# EAGLE design GD32Fx07R-dev-board (EAGLE 9.6.2)
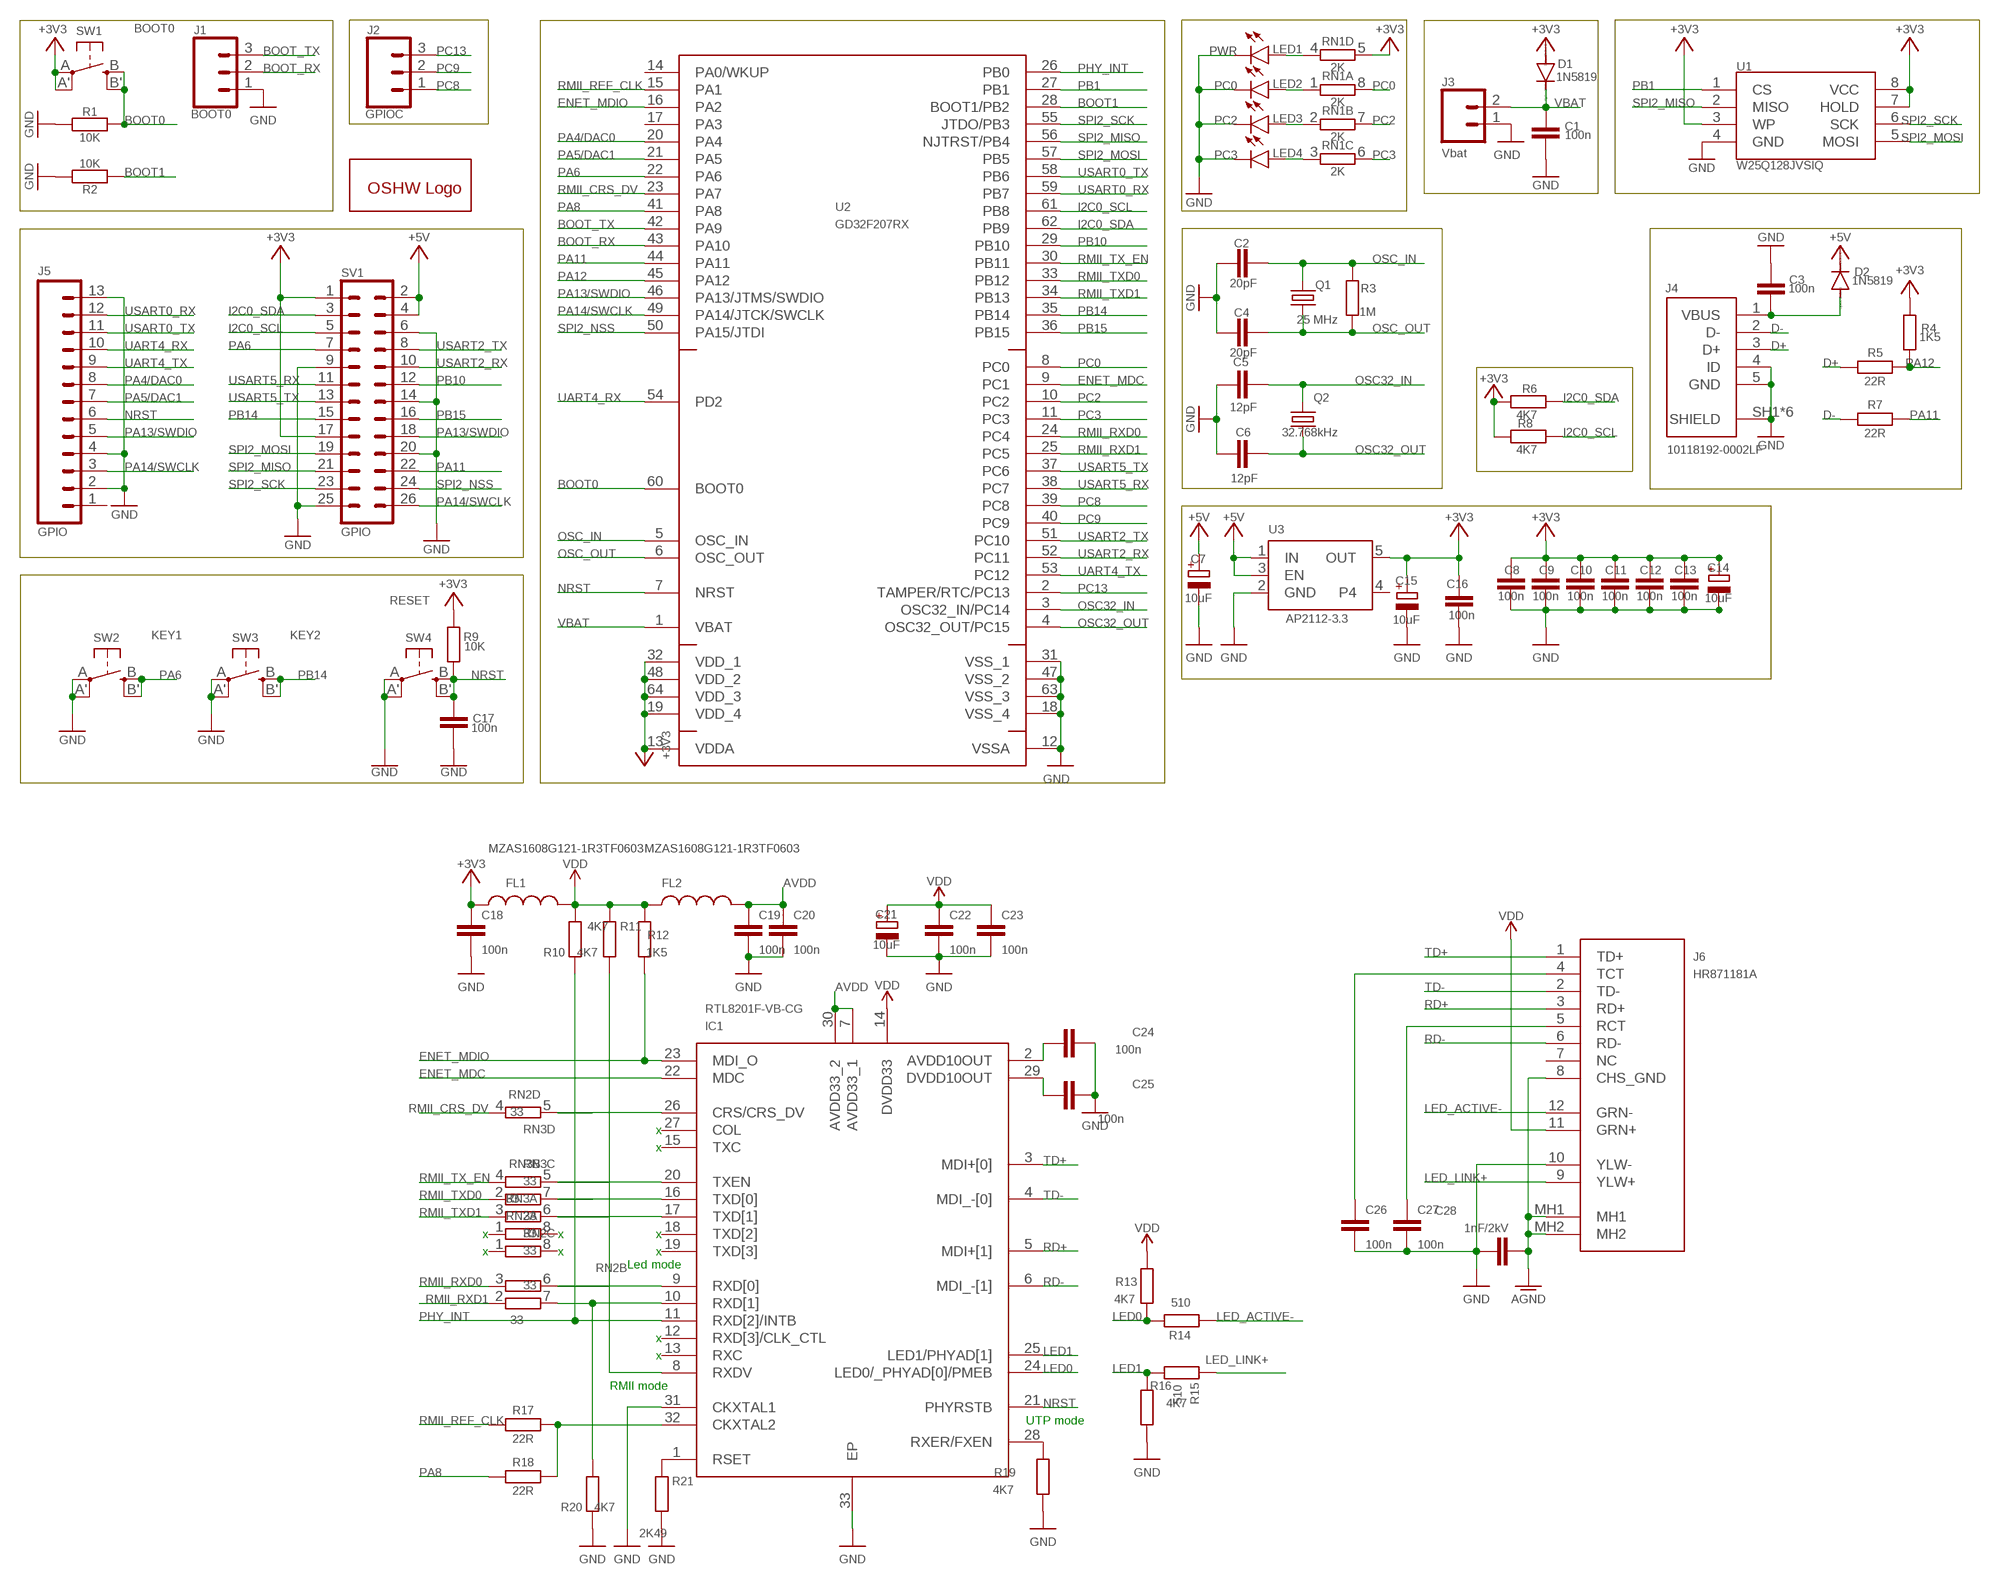
[diagram p0: schematic, sheet 1]

## Parts
C1  100n  C-EUC0603  [C0603]
C2  20pF  C-EUC0603  [C0603]
C3  100n  C-EUC0603  [C0603]
C4  20pF  C-EUC0603  [C0603]
C5  12pF  C-EUC0603  [C0603]
C6  12pF  C-EUC0603  [C0603]
C7  10uF  CPOL-EUA/3216-18R  [A/3216-18R]
C8  100n  C-EUC0603  [C0603]
C9  100n  C-EUC0603  [C0603]
C10  100n  C-EUC0603  [C0603]
C11  100n  C-EUC0603  [C0603]
C12  100n  C-EUC0603  [C0603]
C13  100n  C-EUC0603  [C0603]
C14  10uF  CPOL-EUA/3216-18R  [A/3216-18R]
C15  10uF  CPOL-EUA/3216-18R  [A/3216-18R]
C16  100n  C-EUC0603  [C0603]
C17  100n  C-EUC0603  [C0603]
C18  100n  C-EUC0603  [C0603]
C19  100n  C-EUC0603  [C0603]
C20  100n  C-EUC0603  [C0603]
C21  10uF  CPOL-EUA/3216-18R  [A/3216-18R]
C22  100n  C-EUC0603  [C0603]
C23  100n  C-EUC0603  [C0603]
C24  100n  C-EUC0603  [C0603]
C25  100n  C-EUC0603  [C0603]
C26  100n  C-EUC0603  [C0603]
C27  100n  C-EUC0603  [C0603]
C28  1nF/2kV  C-EUC1206  [C1206]
D1  1N5819  DIODE-SOD323-R  [SOD323-R]
D2  1N5819  DIODE-SOD323-R  [SOD323-R]
FL1  MZAS1608G121-1R3TF0603  [0603]
FL2  MZAS1608G121-1R3TF0603  [0603]
GOLD_ORB_SM1  OSHWLOGOLOGO5MM  [OSHW_5MM]
IC1  RTL8201F-VB-CG  [QFN50P500X500X100-33N]
J1  BOOT0  CONN_03  [1X03]
J2  GPIOC  CONN_03  [1X03]
J3  Vbat  CONN_021X02_NO_SILK  [1X02_NO_SILK]
J4  10118192-0002LF  [10118192-0002LF]
J5  GPIO  CONN_13  [1X13]
J6  HR871181A  [HR871181A]
LED1  PWR  LEDCHIP-LED0603  [CHIP-LED0603]
LED2  PC0  LEDCHIP-LED0603  [CHIP-LED0603]
LED3  PC2  LEDCHIP-LED0603  [CHIP-LED0603]
LED4  PC3  LEDCHIP-LED0603  [CHIP-LED0603]
Q1  25 MHz  CSM-7X-DU  [CSM-7X-DU]
Q2  32.768kHz  KX-327-NHT  [3.2X1.5]
R1  10K  R-EU_R0603  [R0603]
R2  10K  R-EU_R0603  [R0603]
R3  1M  R-EU_R0603  [R0603]
R4  1K5  R-EU_R0603  [R0603]
R5  22R  R-EU_R0603  [R0603]
R6  4K7  R-EU_R0603  [R0603]
R7  22R  R-EU_R0603  [R0603]
R8  4K7  R-EU_R0603  [R0603]
R9  10K  R-EU_R0603  [R0603]
R10  4K7  R-EU_R0603  [R0603]
R11  4K7  R-EU_R0603  [R0603]
R12  1K5  R-EU_R0603  [R0603]
R13  4K7  R-EU_R0603  [R0603]
R14  510  R-EU_R0603  [R0603]
R15  510  R-EU_R0603  [R0603]
R16  4K7  R-EU_R0603  [R0603]
R17  22R  R-EU_R0603  [R0603]
R18  22R  R-EU_R0603  [R0603]
R19  4K7  R-EU_R0603  [R0603]
R20  4K7  R-EU_R0603  [R0603]
R21  2K49  R-EU_R0603  [R0603]
RN1  2K  4R-N0402ARV341  [4X0402ARV341]
RN2  33  4R-N0402ARV341  [4X0402ARV341]
RN3  33  4R-N0402ARV341  [4X0402ARV341]
SV1  GPIO  GPIO-13-2  [MA13-2]
SW1  BOOT0  SPST_TACT-EVQQ2  [EVQ-Q2]
SW2  KEY1  SPST_TACT-EVQQ2  [EVQ-Q2]
SW3  KEY2  SPST_TACT-EVQQ2  [EVQ-Q2]
SW4  RESET  SPST_TACT-EVQQ2  [EVQ-Q2]
U1  W25Q128JVSIQ  SPI_FLASH-X25XXSMD1  [SO08-EIAJ]
U2  GD32F207RX  [LQFP64]
U3  AP2112-3.3  LDO  [SOT23-5]

## Nets
+3V3: C8.1 C9.1 C10.1 C11.1 C12.1 C13.1 C14.+ C15.+ C16.1 C18.1 D1.A FL1.1 R4.2 R6.2 R8.2 R9.2 RN1.5 SV1.1 SV1.17 SW1.A'(P1) SW1.A(P) U1.3(WP) U1.7(HOLD) U1.8(VCC) U2.13(VDDA) U2.19(VDD_4) U2.32(VDD_1) U2.48(VDD_2) U2.64(VDD_3) U3.5(OUT)
+5V: C7.+ D2.C SV1.2 SV1.4 U3.1(IN) U3.3(EN)
AGND: C28.2 J6.8(CHS_GND) J6.MH1 J6.MH2
AVDD: C19.1 C20.1 FL2.2 IC1.7(AVDD33_1) IC1.30(AVDD33_2)
BOOT0: R1.2 SW1.B'(S1) SW1.B(S) U2.60(BOOT0)
BOOT1: R2.1 U2.28(BOOT1/PB2)
BOOT_RX: J1.2 U2.43(PA10)
BOOT_TX: J1.3 U2.42(PA9)
CLOCK: IC1.32(CKXTAL2) R17.2 R18.2
D+: J4.3(D+) R5.1
D-: J4.2(D-) R7.1
ENET_MDC: IC1.22(MDC) U2.9(PC1)
ENET_MDIO: IC1.23(MDI_O) R12.1 U2.16(PA2)
GND: C1.2 C2.1 C3.1 C4.1 C5.1 C6.1 C7.- C8.2 C9.2 C10.2 C11.2 C12.2 C13.2 C14.- C15.- C16.2 C17.2 C18.2 C19.2 C20.2 C21.- C22.2 C23.2 C24.1 C25.1 C26.2 C27.2 C28.1 IC1.31(CKXTAL1) IC1.33(EP) J1.1 J3.1 J4.4(ID) J4.5(GND) J4.SH1(SHIELD) J4.SH2(SHIELD) J4.SH3(SHIELD) J4.SH4(SHIELD) J4.SH5(SHIELD) J4.SH6(SHIELD) J5.2 J5.4 J5.13 J6.10(YLW-) LED1.C LED2.C LED3.C LED4.C R1.1 R2.2 R16.1 R19.1 R20.1 R21.2 SV1.6 SV1.9 SV1.14 SV1.20 SV1.25 SW2.A'(P1) SW2.A(P) SW3.A'(P1) SW3.A(P) SW4.A'(P1) SW4.A(P) U1.4(GND) U2.12(VSSA) U2.18(VSS_4) U2.31(VSS_1) U2.47(VSS_2) U2.63(VSS_3) U3.2(GND)
I2C0_SCL: R8.1 SV1.5 U2.61(PB8)
I2C0_SDA: R6.1 SV1.3 U2.62(PB9)
LED0: IC1.24(LED0/_PHYAD[0]/PMEB) R13.1 R14.2
LED1: IC1.25(LED1/PHYAD[1]) R15.2 R16.2
LED_ACTIVE-: J6.12(GRN-) R14.1
LED_LINK+: J6.9(YLW+) R15.1
N$1: C24.2 IC1.2(AVDD10OUT)
N$4: IC1.1(RSET) R21.1
N$5: IC1.8(RXDV) R11.2
N$6: C25.2 IC1.29(DVDD10OUT)
N$7: IC1.28(RXER/FXEN) R19.2
N$9: C27.1 J6.5(RCT)
N$10: LED2.A RN1.1
N$11: LED3.A RN1.2
N$12: C26.1 J6.4(TCT)
N$25: LED4.A RN1.3
N$26: LED1.A RN1.4
NRST: C17.1 IC1.21(PHYRSTB) J5.6 R9.1 SW4.B'(S1) SW4.B(S) U2.7(NRST)
OSC32_IN: C5.2 Q2.2 U2.3(OSC32_IN/PC14)
OSC32_OUT: C6.2 Q2.1 U2.4(OSC32_OUT/PC15)
OSC_IN: C2.2 Q1.2 R3.1 U2.5(OSC_IN)
OSC_OUT: C4.2 Q1.1 R3.2 U2.6(OSC_OUT)
PA4/DAC0: J5.8 U2.20(PA4)
PA5/DAC1: J5.7 U2.21(PA5)
PA6: SV1.7 SW2.B'(S1) SW2.B(S) U2.22(PA6)
PA8: R18.1 U2.41(PA8)
PA11: R7.2 SV1.22 U2.44(PA11)
PA12: R4.1 R5.2 U2.45(PA12)
PA13/SWDIO: J5.5 SV1.18 U2.46(PA13/JTMS/SWDIO)
PA14/SWCLK: J5.3 SV1.26 U2.49(PA14/JTCK/SWCLK)
PB1: U1.1(CS) U2.27(PB1)
PB10: SV1.12 U2.29(PB10)
PB14: SV1.15 SW3.B'(S1) SW3.B(S) U2.35(PB14)
PB15: SV1.16 U2.36(PB15)
PC0: RN1.8 U2.8(PC0)
PC2: RN1.7 U2.10(PC2)
PC3: RN1.6 U2.11(PC3)
PC8: J2.1 U2.39(PC8)
PC9: J2.2 U2.40(PC9)
PC13: J2.3 U2.2(TAMPER/RTC/PC13)
PHY_INT: IC1.11(RXD[2]/INTB) R10.1 U2.26(PB0)
RD+: IC1.5(MDI+[1]) J6.3(RD+)
RD-: IC1.6(MDI_-[1]) J6.6(RD-)
RMII_CRS_DV: RN2.4 U2.23(PA7)
RMII_REF_CLK: R17.1 U2.15(PA1)
RMII_RXD0: RN2.3 U2.24(PC4)
RMII_RXD1: RN2.2 U2.25(PC5)
RMII_TX_EN: RN3.4 U2.30(PB11)
RMII_TXD0: RN3.2 U2.33(PB12)
RMII_TXD1: RN3.3 U2.34(PB13)
RXD0: IC1.9(RXD[0]) RN2.6
RXD1: IC1.10(RXD[1]) R20.2 RN2.7
RXDV: IC1.26(CRS/CRS_DV) RN2.5
SPI2_MISO: SV1.21 U1.2(MISO) U2.56(NJTRST/PB4)
SPI2_MOSI: SV1.19 U1.5(MOSI) U2.57(PB5)
SPI2_NSS: SV1.24 U2.50(PA15/JTDI)
SPI2_SCK: SV1.23 U1.6(SCK) U2.55(JTDO/PB3)
TD+: IC1.3(MDI+[0]) J6.1(TD+)
TD-: IC1.4(MDI_-[0]) J6.2(TD-)
TXD0: IC1.16(TXD[0]) RN3.7
TXD1: IC1.17(TXD[1]) RN3.6
TXEN: IC1.20(TXEN) RN3.5
UART4_RX: J5.10 U2.54(PD2)
UART4_TX: J5.9 U2.53(PC12)
USART0_RX: J5.12 U2.59(PB7)
USART0_TX: J5.11 U2.58(PB6)
USART2_RX: SV1.10 U2.52(PC11)
USART2_TX: SV1.8 U2.51(PC10)
USART5_RX: SV1.11 U2.38(PC7)
USART5_TX: SV1.13 U2.37(PC6)
VBAT: C1.1 D1.C J3.2 U2.1(VBAT)
VBUS: C3.2 D2.A J4.1(VBUS)
VDD: C21.+ C22.1 C23.1 FL1.2 FL2.1 IC1.14(DVDD33) J6.11(GRN+) R10.2 R11.1 R12.2 R13.2
Unconnected: IC1.12(RXD[3]/CLK_CTL) IC1.13(RXC) IC1.15(TXC) IC1.18(TXD[2]) IC1.19(TXD[3]) IC1.27(COL) J5.1 J6.7(NC) RN2.1 RN2.8 RN3.1 RN3.8 U2.14(PA0/WKUP) U2.17(PA3) U3.4

## Notes on the sheet
- x
- x
- x | x | x
- x | x | x
- Led mode
- x
- x
- RMII mode
- UTP mode

## Library data of the parts
C1 C3 C8-C13 C16-C20 C22-C27 = rcl:C-EU: CAPACITOR, European symbol; JLCPCB: C14663; SPICEPREFIX: C
C2 C4-C6 = rcl:C-EU: CAPACITOR, European symbol; JLCPCB: C38523; SPICEPREFIX: C
C7 C14 C15 C21 = rcl:CPOL-EU: POLARIZED CAPACITOR, European symbol; JLCPCB: C7171; SPICEPREFIX: C
C28 = rcl:C-EU: CAPACITOR, European symbol; JLCPCB: C9196; SPICEPREFIX: C
D1 D2 = diode:DIODE-: DIODE; JLCPCB: C191023
FL1 FL2 = Ethernet:MZAS1608G121-1R3TF: 1.3A 1 140mΩ 120Ω@100MHz ±25% 0603 Ferrite Beads ROHS; JLCPCB: C709642
GOLD_ORB_SM1 = oshw:OSHWLOGO: The OSHW logo for PCB layout
IC1 = Ethernet:RTL8201F-VB-CG: RTL8201F Series 3.63 V Single Chip/Port 10/100 M Ethernet Phyceiver w/ auto MDIX Source: Datasheet <https://pdf1.alldatasheet.com/datasheet-pdf/view/1132250/REALTEK/RTL8201F-VB-CG.html>; DESCRIPTION: RTL8201F Series 3.63 V Single Chip/Port 10/100 M Ethernet Phyceiver w/ auto MDIX; JLCPCB: C45044; MANUFACTURER_NAME: Realtek; MANUFACTURER_PART_NUMBER: RTL8201F-VB-CG
J1 J2 = SparkFun-Connectors:CONN_03: Multi connection point. Often used as Generic Header-pin footprint for 0.1 inch spaced/style header connections On any of the 0.1 inch spaced packages, you can populate with these: Break Away Headers - Straight <https://www.sparkfun.com/products/116> (PRT-00116) Break Away Male Headers - Right Angle <https://www.sparkfun.com/products/553> (PRT-00553) Female Headers <https://www.sparkfun.com/products/115> (PRT-00115) Break Away Headers - Machine Pin <https://www.sparkfun.com/products/117> (PRT-00117) Break Away Female Headers - Swiss Machine Pin <https://www.sparkfun.com/products/743> (PRT-00743) Stackable Header - 3 Pin (Female, 0.1") <https://www.sparkfun.com/products/13875> (PRT-13875) For SCREWTERMINALS and SPRING TERMINALS visit here: Screw Terimnals on SparkFun.com <https://www.sparkfun.com/search/results?term=Screw+Terminals> (5mm/3.5mm/2.54mm spacing) This device is also useful as a general connection point to wire up your design to another part of your project. Our various solder wires solder well into these plated through hole pads. Hook-Up Wire - Assortment (Stranded, 22 AWG) <https://www.sparkfun.com/products/11375> (PRT-11375) Hook-Up Wire - Assortment (Solid Core, 22 AWG) <https://www.sparkfun.com/products/11367> (PRT-11367) View the entire wire category on our website here <https://www.sparkfun.com/categories/141> Special notes: Molex polarized connector foot print use with SKU : PRT-08232 with associated crimp pins and housings.
J3 = SparkFun-Connectors:CONN_02: Multi connection point. Often used as Generic Header-pin footprint for 0.1 inch spaced/style header connections On any of the 0.1 inch spaced packages, you can populate with these: Break Away Headers - Straight <https://www.sparkfun.com/products/116> (PRT-00116) Break Away Male Headers - Right Angle <https://www.sparkfun.com/products/553> (PRT-00553) Female Headers <https://www.sparkfun.com/products/115> (PRT-00115) Break Away Headers - Machine Pin <https://www.sparkfun.com/products/117> (PRT-00117) Break Away Female Headers - Swiss Machine Pin <https://www.sparkfun.com/products/743> (PRT-00743) For SCREWTERMINALS and SPRING TERMINALS visit here: Screw Terimnals on SparkFun.com <https://www.sparkfun.com/search/results?term=Screw+Terminals> (5mm/3.5mm/2.54mm spacing) This device is also useful as a general connection point to wire up your design to another part of your project. Our various solder wires solder well into these plated through hole pads. Hook-Up Wire - Assortment (Stranded, 22 AWG) <https://www.sparkfun.com/products/11375> (PRT-11375) Hook-Up Wire - Assortment (Solid Core, 22 AWG) <https://www.sparkfun.com/products/11367> (PRT-11367) View the entire wire category on our website here <https://www.sparkfun.com/categories/141> Special notes: Molex polarized connector foot print use with: PRT-08233 with associated crimp pins and housings. 2.54_SCREWTERM for use with PRT-10571. 3.5mm Screw Terminal footprints for PRT-08084 5mm Screw Terminal footprints for use with PRT-08432
J4 = USB connector:10118192-0002LF: CONN RCPT USB2.0 MICRO B SMD R/A Manufacturer's datasheet <https://www.amphenol-icc.com/media/wysiwyg/files/drawing/10118192.pdf>; CREATED_BY: PCBLayout.com; DIGIKEY_PARTNO: 609-5379-2-ND; JLCPCB: C2972784; MANUFACTURER: Amphenol ICC (FCI); MPN: 10118192-0002LF
J5 = SparkFun-Connectors:CONN_13: Multi connection point. Often used as Generic Header-pin footprint for 0.1 inch spaced/style header connections On any of the 0.1 inch spaced packages, you can populate with these: Break Away Headers - Straight <https://www.sparkfun.com/products/116> (PRT-00116) Break Away Male Headers - Right Angle <https://www.sparkfun.com/products/553> (PRT-00553) Female Headers <https://www.sparkfun.com/products/115> (PRT-00115) Break Away Headers - Machine Pin <https://www.sparkfun.com/products/117> (PRT-00117) Break Away Female Headers - Swiss Machine Pin <https://www.sparkfun.com/products/743> (PRT-00743) For SCREWTERMINALS and SPRING TERMINALS visit here: Screw Terimnals on SparkFun.com <https://www.sparkfun.com/search/results?term=Screw+Terminals> (5mm/3.5mm/2.54mm spacing) This device is also useful as a general connection point to wire up your design to another part of your project. Our various solder wires solder well into these plated through hole pads. Hook-Up Wire - Assortment (Stranded, 22 AWG) <https://www.sparkfun.com/products/11375> (PRT-11375) Hook-Up Wire - Assortment (Solid Core, 22 AWG) <https://www.sparkfun.com/products/11367> (PRT-11367) View the entire wire category on our website here <https://www.sparkfun.com/categories/141> Special notes: Molex polarized connector foot print use with SKU : PRT-08231 with associated crimp pins and housings. 1MM SMD Version SKU: PRT-10208 NOTES ON THE VARIANTS LOCK and LOCK_LONGPADS... This footprint was designed to help hold the alignment of a through-hole component (i.e. 6-pin header) while soldering it into place. You may notice that each hole has been shifted either up or down by 0.005 of an inch from it's more standard position (which is a perfectly straight line). This slight alteration caused the pins (the squares in the middle) to touch the edges of the holes. Because they are alternating, it causes a "brace" to hold the component in place. 0.005 has proven to be the perfect amount of "off-center" position when using our standard breakaway headers. Although looks a little odd when you look at the bare footprint, once you have a header in there, the alteration is very hard to notice. Also,if you push a header all the way into place, it is covered up entirely on the bottom side.
J6 = Ethernet:HR871181A: RJ45 12 1 Shielded Green - Yellow Through Hole Ethernet Connectors/Modular Connectors (RJ45 RJ11) RoHS Source: Datasheet <https://datasheet.lcsc.com/szlcsc/1811141116_HANRUN-Zhongshan-HanRun-Elec-HR871181A_C49312.pdf>; DESCRIPTION: RJ45 12 1 Shielded Green - Yellow Through Hole Ethernet Connectors/Modular Connectors (RJ45 RJ11) RoHS; JLCPCB: C49312; MANUFACTURER_NAME: Hanrun Electronics; MANUFACTURER_PART_NUMBER: HR871181A
LED1-LED4 = led:LED: LED OSRAM: - CHIPLED LG R971, LG N971, LY N971, LG Q971, LY Q971, LO R971, LY R971 LH N974, LH R974 LS Q976, LO Q976, LY Q976 LO Q996 - Hyper CHIPLED LW Q18S LB Q993, LB Q99A, LB R99A - SideLED LS A670, LO A670, LY A670, LG A670, LP A670 LB A673, LV A673, LT A673, LW A673 LH A674 LY A675 LS A676, LA A676, LO A676, LY A676, LW A676 LS A679, LY A679, LG A679 - Hyper Micro SIDELED® LS Y876, LA Y876, LO Y876, LY Y876 LT Y87S - SmartLED LW L88C, LW L88S LB L89C, LB L89S, LG L890 LS L89K, LO L89K, LY L89K LS L896, LA L896, LO L896, LY L896 - TOPLED LS T670, LO T670, LY T670, LG T670, LP T670 LSG T670, LSP T670, LSY T670, LOP T670, LYG T670 LG T671, LOG T671, LSG T671 LB T673, LV T673, LT T673, LW T673 LH T674 LS T676, LA T676, LO T676, LY T676, LB T676, LH T676, LSB T676, LW T676 LB T67C, LV T67C, LT T67C, LS T67K, LO T67K, LY T67K, LW E67C LS E67B, LA E67B, LO E67B, LY E67B, LB E67C, LV E67C, LT E67C LW T67C LS T679, LY T679, LG T679 LS T770, LO T770, LY T770, LG T770, LP T770 LB T773, LV T773, LT T773, LW T773 LH T774 LS E675, LA E675, LY E675, LS T675 LS T776, LA T776, LO T776, LY T776, LB T776 LHGB T686 LT T68C, LB T68C - Hyper Mini TOPLED® LB M676 - Mini TOPLED Santana® LG M470 LS M47K, LO M47K, LY M47K Source: http://www.osram.convergy.de LUXEON: - LUMILED® LXK2-PW12-R00, LXK2-PW12-S00, LXK2-PW14-U00, LXK2-PW14-V00 LXK2-PM12-R00, LXK2-PM12-S00, LXK2-PM14-U00 LXK2-PE12-Q00, LXK2-PE12-R00, LXK2-PE12-S00, LXK2-PE14-T00, LXK2-PE14-U00 LXK2-PB12-K00, LXK2-PB12-L00, LXK2-PB12-M00, LXK2-PB14-N00, LXK2-PB14-P00, LXK2-PB14-Q00 LXK2-PR12-L00, LXK2-PR12-M00, LXK2-PR14-Q00, LXK2-PR14-R00 LXK2-PD12-Q00, LXK2-PD12-R00, LXK2-PD12-S00 LXK2-PH12-R00, LXK2-PH12-S00 LXK2-PL12-P00, LXK2-PL12-Q00, LXK2-PL12-R00 Source: www.luxeon.com KINGBRIGHT: KA-3528ASYC Source: www.kingbright.com; JLCPCB: C72043
Q1 = crystal:CSM-7X-DU: SMD CRYSTAL Source: www.ecsxtal.com .. Crystal 3.6864MHz CSM_7X_DU.PDF; JLCPCB: C14872; OC_FARNELL: unknown; OC_NEWARK: unknown
Q2 = crystal-geyer_V1_0:KX-327: Tuning Fork Crystals (kHz) SMD: KX327 - Serie Model Size l/w/h [mm] Frequency Range Frequency Stability Temp. Range [°C] Load Capacitance AECQ 200 availabel Datasheet KX-327VT KX-327FT KX-327RT KX-327NHT KX-327NHF KX-327L KX-327S 1.25/1.05/0.5 1.6/1.0/0.5 2.0/1.2/0.6 3.2/1.5/0.8 3.2/1.5/0.8 7.0/1.5/1.4 8.2/3.8/2.5 32,768 kHz 32,768 kHz 32,768 kHz 32,768 kHz 32,768 kHz 32,768 kHz 32,768 kHz ±10 … ±20ppm ±10 … ±20ppm ±10 … ±20ppm ±10 … ±20ppm ±10 … ±20ppm ±10 … ±20ppm ±5 … ±20ppm (*) -40°C …+85°C (*) -40°C …+85°C (*) -40°C …+85°C (*) -40°C …+85°C (*) -40°C …+125°C (*) -40°C …+85°C (*) -40°C …+85°C 7/9/12,5 7/9/12,5 7/9/12,6 7/9/12,5 9/12,5 7/9/12,5 6/12,5 - - - - yes - - KX-327VT.pdf <http://www.geyer-electronic.de/uploads/tx_userartikelfrequenz/GEYER-KX-327VT.pdf> KX-327FT.pdf <http://www.geyer-electronic.de/uploads/tx_userartikelfrequenz/GEYER-KX-327FT.pdf> KX-327RT.pdf <http://www.geyer-electronic.de/uploads/tx_userartikelfrequenz/GEYER-KX-327RT.pdf> KX-327NHT.pdf <http://www.geyer-electronic.de/uploads/tx_userartikelfrequenz/GEYER-KX-327NHT.pdf> KX-327NHF.pdf <http://www.geyer-electronic.de/uploads/tx_userartikelfrequenz/GEYER-KX-327NHF.pdf> KX-327L.pdf <http://www.geyer-electronic.de/uploads/tx_userartikelfrequenz/GEYER-KX-327L.pdf> KX-327S.pdf <http://www.geyer-electronic.de/uploads/tx_userartikelfrequenz/GEYER-KX-327S.pdf> <http://www.geyer-electronic.de/fileadmin/template/img/logo-geyer-electronic.png> Details see: http://www.geyer-electronic.de/Frequenz-Produkte.9.0.html Created 2016-06-07, Hans Locher 2016 (C) Geyer Quartz Technology KX327VT,KX327FT,KX327RT,KX327NHT,KX327NHF,KX327S,KX327L;125105;1610;2012;3215;7015;8238;1,25x1,05,1.25x1.05;1,6x1,0,1.6x1.0;2,0x1,2,2.0x1.2;3,2x1,5,3.2x1.5;8,2x3,8,8.2x3.8,7.0x1.5,7,0x1,532.768kHz; JLCPCB: C32346
R1 R2 R9 = rcl:R-EU_: RESISTOR, European symbol; JLCPCB: C25804; SPICEPREFIX: R
R3 = rcl:R-EU_: RESISTOR, European symbol; JLCPCB: C22935; SPICEPREFIX: R
R4 R12 = rcl:R-EU_: RESISTOR, European symbol; JLCPCB: C22843; SPICEPREFIX: R
R5 R7 R17 R18 = rcl:R-EU_: RESISTOR, European symbol; JLCPCB: C23345; SPICEPREFIX: R
R6 R8 R10 R11 R13 R16 R19 R20 = rcl:R-EU_: RESISTOR, European symbol; JLCPCB: C23162; SPICEPREFIX: R
R14 R15 = rcl:R-EU_: RESISTOR, European symbol; JLCPCB: C23193; SPICEPREFIX: R
R21 = rcl:R-EU_: RESISTOR, European symbol; JLCPCB: C100897; SPICEPREFIX: R
RN1 = resistor-dil:4R-N: Array Chip Resistor Source: RS Component / Phycomp; JLCPCB: C44891; OC_FARNELL: unknown; OC_NEWARK: unknown
RN2 RN3 = resistor-dil:4R-N: Array Chip Resistor Source: RS Component / Phycomp; JLCPCB: C25501; OC_FARNELL: unknown; OC_NEWARK: unknown
SV1 = GD32F:GPIO-13-2: PIN HEADER
SW1-SW4 = adafruit:SPST_TACT: SMT 6mm switch, EVQQ2 series http://www.ladyada.net/library/eagle; JLCPCB: C221880
U1 = SparkFun-IC-Memory:SPI_FLASH-X25XX: 32M Serial Flash Memory 8pin SPI Flash series x25xx. Works with devices like W25X32 and BR25L32 Datasheet <http://www.macronix.com/Lists/Datasheet/Attachments/5031/MX25L3206E,%203V,%2032Mb,%20v1.5.pdf> SparkFun Products SparkFun Venus GPS Logger <https://www.sparkfun.com/products/10920> (GPS-10920); JLCPCB: C97521; PROD_ID: IC-09109; VALUE: 25F32006WSOI
U2 = GD32F:GD32F207RX: The GD32F207xx device belongs to the performance line of GD32 MCU Family.; DATASHEET: http://www.gd32mcu.com/en/download/0?kw=GD32F2; SUPPLIER: GigaDevice
U3 = GD32F:LDO: SOT23-5 Fixed Voltage Regulator; JLCPCB: C51118

## Board
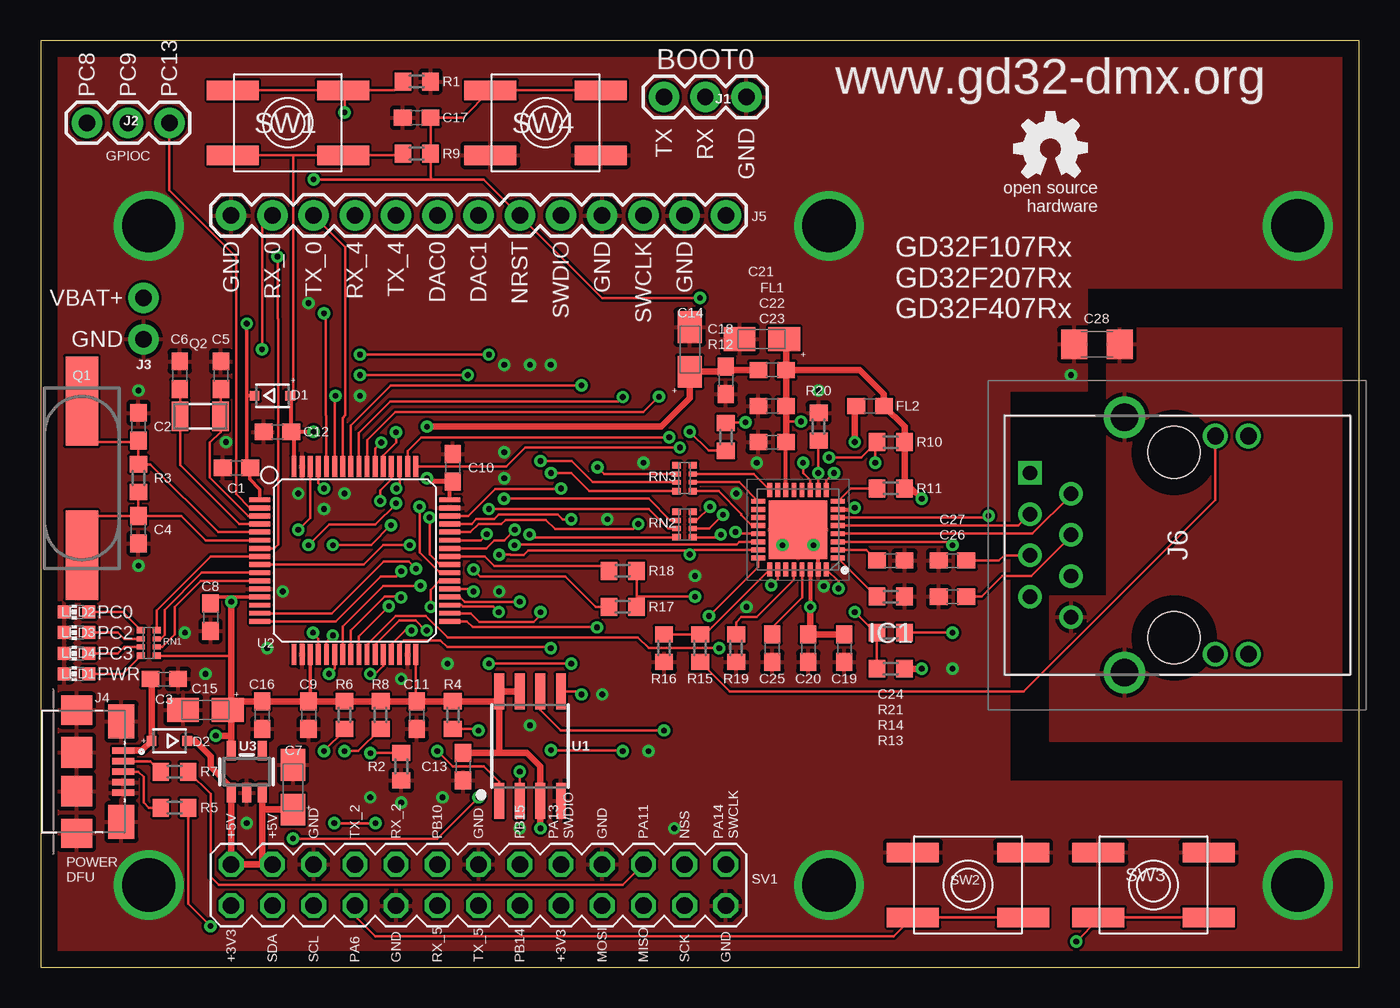
[diagram p1: board, top side]
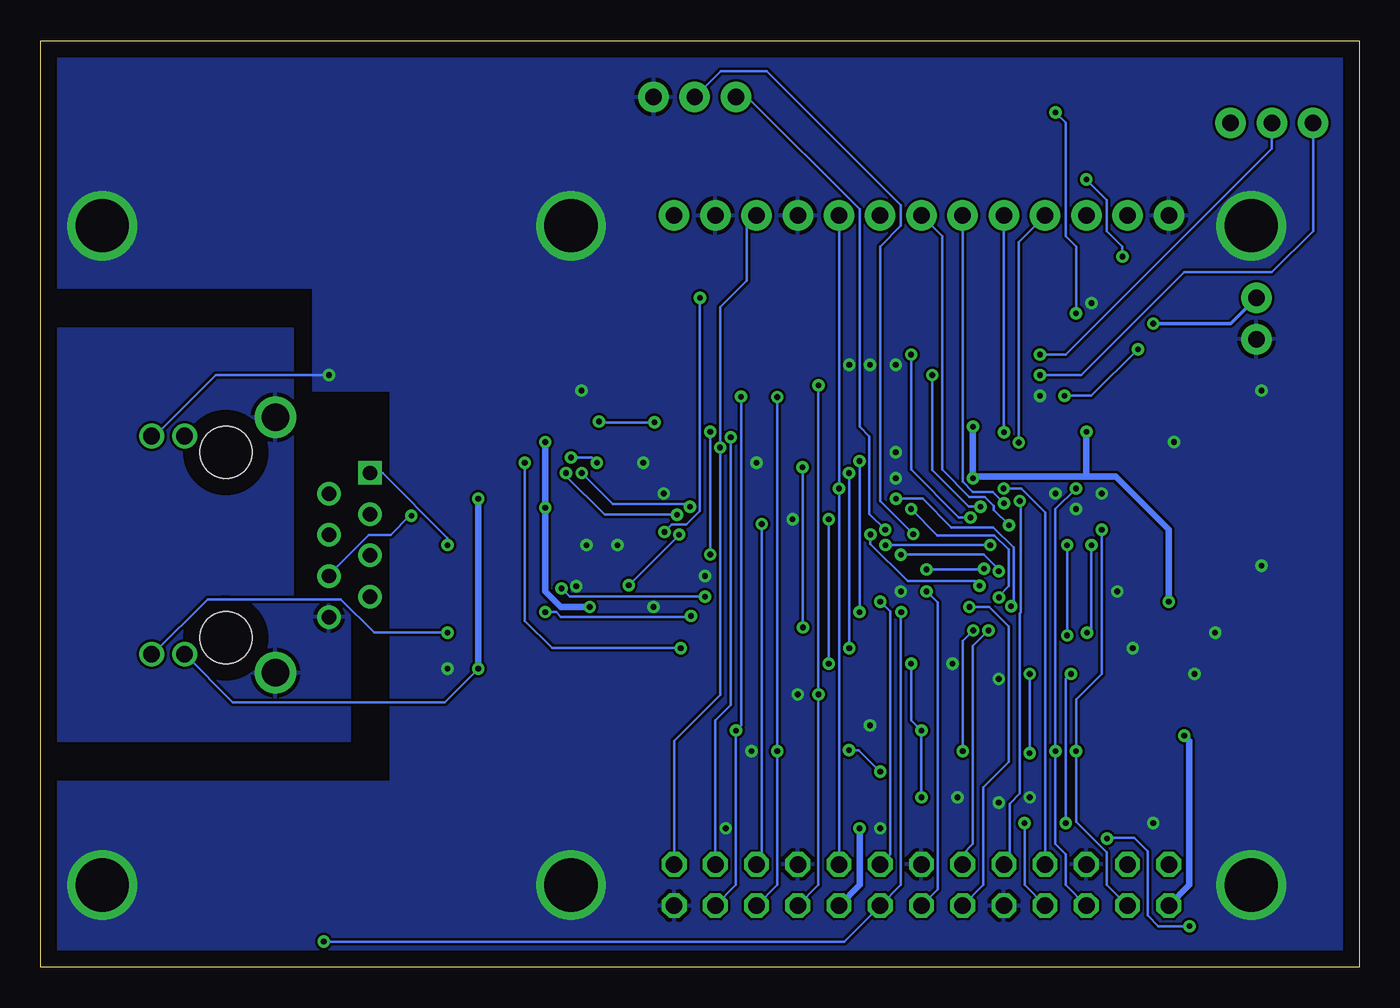
[diagram p2: board, bottom side, seen from below]

Size 81.27 x 57.14 mm. Coordinates in mm from the lower left corner, seen from the top.
Outline: 0,0 81.27,0 81.27,57.14 0,57.14 0,0
Copper layers (1*16): Top 0.035mm / dielectric 1.5mm / Bottom 0.035mm
Design rules "default": minimum track width 6mil, minimum drill 0.35mm, track to track 6mil, track to pad 6mil, pad to pad 6mil, via to via 6mil, smd to smd 6mil, copper to edge 40mil, drill to drill 6mil, minimum pad ring 10mil, minimum via ring 8mil, stop-mask expansion 4mil, vias tented up to drill 0mil, thermal gap 10mil

### Footprints (pad centres in the part's own frame; a part is rotated, then mirrored left to right if it is on the bottom)
C0603 = smd 1.1 x 1: 1 -0.85,0; 2 0.85,0
A/3216-18R = smd 1.95 x 1.5: + 1.375,0; - -1.375,0
C1206 = smd 1.6 x 1.8: 1 -1.4,0; 2 1.4,0
SOD323-R = smd 0.6 x 0.6: A 1.1,0; C -1.1,0
0603 = smd 1.1 x 1: 1 -0.85,0; 2 0.85,0
QFN50P500X500X100-33N = smd 0.85 x 0.3: 1 -2.45,1.75; 2 -2.45,1.25; 3 -2.45,0.75; 4 -2.45,0.25; 5 -2.45,-0.25; 6 -2.45,-0.75; 7 -2.45,-1.25; 8 -2.45,-1.75; 17 2.45,-1.75; 18 2.45,-1.25; 19 2.45,-0.75; 20 2.45,-0.25; 21 2.45,0.25; 22 2.45,0.75; 23 2.45,1.25; 24 2.45,1.75 | smd 0.3 x 0.85: 9 -1.75,-2.45; 10 -1.25,-2.45; 11 -0.75,-2.45; 12 -0.25,-2.45; 13 0.25,-2.45; 14 0.75,-2.45; 15 1.25,-2.45; 16 1.75,-2.45; 25 1.75,2.45; 26 1.25,2.45; 27 0.75,2.45; 28 0.25,2.45; 29 -0.25,2.45; 30 -0.75,2.45; 31 -1.25,2.45; 32 -1.75,2.45 | smd 3.6 x 3.6: 33 0,0
1X03 = drill 1.016 pad 1.88: 1 0,0; 2 2.54,0; 3 5.08,0
1X02_NO_SILK = drill 1.016 pad 1.88: 1 0,0; 2 2.54,0
10118192-0002LF = smd 0.4 x 1.35: 1 -1.3,2.875; 2 -0.65,2.875; 3 0,2.875; 4 0.65,2.875; 5 1.3,2.875 | smd 2.1 x 1.6: SH1 -3.1,2.75; SH2 3.1,2.75 | smd 1.8 x 1.9: SH3 -3.8,0; SH4 3.8,0 | smd 1.9 x 1.9: SH5 -1.2,0; SH6 1.2,0
1X13 = drill 1.016 pad 1.88: 1 0,0; 2 2.54,0; 3 5.08,0; 4 7.62,0; 5 10.16,0; 6 12.7,0; 7 15.24,0; 8 17.78,0; 9 20.32,0; 10 22.86,0; 11 25.4,0; 12 27.94,0; 13 30.48,0
HR871181A = drill 0.89 pad 1.446 square: 1 0,0 | drill 0.89 pad 1.446: 2 1.27,2.54; 3 2.54,0; 4 3.81,2.54; 5 5.08,0; 6 6.35,2.54; 7 7.62,0; 8 8.89,2.54 | drill 1.02 pad 1.53: 9 -2.28,11.43; 10 -2.28,13.46; 11 11.17,11.43; 12 11.17,13.46 | drill 1.7 pad 2.55: MH1 -3.43,5.84; MH2 12.32,5.84 | hole 3.2: -1.27,8.89; 10.16,8.89
CHIP-LED0603 = smd 0.8 x 0.8: A 0,-0.75; C 0,0.75
CSM-7X-DU = smd 5.5 x 2: 1 -4.75,0; 2 4.75,0
3.2X1.5 = smd 1 x 1.8: 1 -1.25,0; 2 1.25,0
R0603 = smd 1 x 1.1: 1 -0.85,0; 2 0.85,0
4X0402ARV341 = smd 0.4 x 0.5: 1 -0.8,-0.5; 4 0.8,-0.5; 5 0.8,0.5; 8 -0.8,0.5 | smd 0.3 x 0.5: 2 -0.25,-0.5; 3 0.25,-0.5; 6 0.25,0.5; 7 -0.25,0.5
MA13-2 = drill 1.016 octagon: 1 -15.24,-1.27; 2 -15.24,1.27; 3 -12.7,-1.27; 4 -12.7,1.27; 5 -10.16,-1.27; 6 -10.16,1.27; 7 -7.62,-1.27; 8 -7.62,1.27; 9 -5.08,-1.27; 10 -5.08,1.27; 11 -2.54,-1.27; 12 -2.54,1.27; 13 0,-1.27; 14 0,1.27; 15 2.54,-1.27; 16 2.54,1.27; 17 5.08,-1.27; 18 5.08,1.27; 19 7.62,-1.27; 20 7.62,1.27; 21 10.16,-1.27; 22 10.16,1.27; 23 12.7,-1.27; 24 12.7,1.27; 25 15.24,-1.27; 26 15.24,1.27
EVQ-Q2 = smd 3.2 x 1.2: A -3.4,-2; A' 3.4,-2; B -3.4,2; B' 3.4,2
SO08-EIAJ = smd 0.61 x 2.21: 1 -1.905,-3.378; 2 -0.635,-3.378; 3 0.635,-3.378; 4 1.905,-3.378; 5 1.905,3.353; 6 0.635,3.353; 7 -0.635,3.353; 8 -1.905,3.353
LQFP64 = smd 1.3 x 0.3: 1 -5.85,3.75; 2 -5.85,3.25; 3 -5.85,2.75; 4 -5.85,2.25; 5 -5.85,1.75; 6 -5.85,1.25; 7 -5.85,0.75; 8 -5.85,0.25; 9 -5.85,-0.25; 10 -5.85,-0.75; 11 -5.85,-1.25; 12 -5.85,-1.75; 13 -5.85,-2.25; 14 -5.85,-2.75; 15 -5.85,-3.25; 16 -5.85,-3.75; 33 5.85,-3.75; 34 5.85,-3.25; 35 5.85,-2.75; 36 5.85,-2.25; 37 5.85,-1.75; 38 5.85,-1.25; 39 5.85,-0.75; 40 5.85,-0.25; 41 5.85,0.25; 42 5.85,0.75; 43 5.85,1.25; 44 5.85,1.75; 45 5.85,2.25; 46 5.85,2.75; 47 5.85,3.25; 48 5.85,3.75 | smd 0.3 x 1.3: 17 -3.75,-5.8; 18 -3.25,-5.8; 19 -2.75,-5.8; 20 -2.25,-5.8; 21 -1.75,-5.8; 22 -1.25,-5.8; 23 -0.75,-5.8; 24 -0.25,-5.8; 25 0.25,-5.8; 26 0.75,-5.8; 27 1.25,-5.8; 28 1.75,-5.8; 29 2.25,-5.8; 30 2.75,-5.8; 31 3.25,-5.8; 32 3.75,-5.8; 49 3.75,5.8; 50 3.25,5.8; 51 2.75,5.8; 52 2.25,5.8; 53 1.75,5.8; 54 1.25,5.8; 55 0.75,5.8; 56 0.25,5.8; 57 -0.25,5.8; 58 -0.75,5.8; 59 -1.25,5.8; 60 -1.75,5.8; 61 -2.25,5.8; 62 -2.75,5.8; 63 -3.25,5.8; 64 -3.75,5.8
SOT23-5 = smd 0.55 x 1.2: 1 -0.95,-1.3; 2 0,-1.3; 3 0.95,-1.3; 4 0.95,1.3; 5 -0.95,1.3

### Placement (x,y rotation side)
C1  12.06,30.8 180 top
C2  6.03,33.34 270 top
C3  7.62,17.78 180 top
C4  6.03,26.99 90 top
C5  11.11,36.51 270 top
C6  8.57,36.51 270 top
C7  15.56,11.11 270 top
C8  10.48,21.59 270 top
C9  16.51,15.56 270 top
C10  25.4,30.8 90 top
C11  23.18,15.56 270 top
C12  14.61,33.02 180 top
C13  26.04,12.38 270 top
C14  40.01,38.1 270 top
C15  10.16,15.88 0 top
C16  13.65,15.56 270 top
C17  23.18,52.39 180 top
C18  42.23,36.2 270 top
C19  49.53,19.68 270 top
C20  47.31,19.68 270 top
C21  44.45,38.73 0 top
C22  45.09,34.61 180 top
C23  45.09,32.38 180 top
C24  52.39,25.08 180 top
C25  45.09,19.68 90 top
C26  56.2,22.86 180 top
C27  56.2,25.08 180 top
C28  65.09,38.42 0 top
D1  14.29,35.24 0 top
D2  7.94,13.97 180 top
FL1  45.09,36.83 0 top
FL2  51.12,34.61 180 top
GOLD_ORB_SM1  62.23,50.48 0 top
IC1  46.67,26.99 180 top
J1  43.5,53.66 180 top
J2  2.86,52.07 0 top
J3  6.35,38.73 90 top
J4  2.22,12.06 270 top
J5  42.23,46.35 180 top
J6  60.96,30.48 270 top
LED1  2.22,18.1 90 top
LED2  2.22,21.91 90 top
LED3  2.22,20.64 90 top
LED4  2.22,19.37 90 top
Q1  2.54,30.16 90 top
Q2  9.84,33.97 0 top
R1  23.18,54.61 180 top
R2  22.23,12.38 270 top
R3  6.03,30.16 270 top
R4  25.4,15.56 90 top
R5  8.26,9.84 0 top
R6  18.73,15.56 90 top
R7  8.26,12.06 0 top
R8  20.95,15.56 90 top
R9  23.18,50.16 180 top
R10  52.39,32.38 0 top
R11  52.39,29.53 180 top
R12  42.23,32.7 90 top
R13  52.39,18.41 0 top
R14  52.39,20.64 180 top
R15  40.64,19.68 90 top
R16  38.42,19.68 90 top
R17  35.88,22.23 0 top
R18  35.88,24.45 0 top
R19  42.86,19.68 90 top
R20  47.94,33.34 270 top
R21  52.39,22.86 0 top
RN1  6.67,20 270 top
RN2  39.69,27.3 270 top
RN3  39.69,30.16 270 top
SV1  26.99,5.08 0 top
SW1  15.24,52.07 0 top
SW2  57.15,5.08 180 top
SW3  68.58,5.08 180 top
SW4  31.11,52.07 0 top
U1  30.16,13.65 0 top
U2  19.37,25.08 0 top
U3  12.7,12.06 0 top

### Tracks (layer width: path | path; a pad name or v marks a point on that pad's centre or on a via)
+3V3  (via drill 0.35)
  Top 0.152: 25.22,29.77 C10.1 | SW1.A 15.56,50.07 | 15.56,50.07 SW1.A' 22.23,50.07 R9.2 | 10.87,22.83 C8.1 | U2.32 23.12,16.47 C11.1 | 15.56,50.07 15.56,35.28 15.46,35.17 | RN1.5 11.58,19.2 11.75,19.37
  Top 0.203: U2.19 16.62,16.52 C9.1 | U2.13 11.75,22.83 | 11.75,22.83 10.87,22.83 | v11.75,22.54 11.75,22.83
  Top 0.254: U2.48 25.22,29.77 | U2.64 15.62,32.86 C12.1 | C12.1 15.46,35.17 D1.A | v16.82,33.02 C12.1
  Top 0.305: C10.1 24.03,29.95 v23.81,30.16
  Top 0.406: U1.7 U1.8 28.26,16.51 | C13.1 28.26,13.23 | 28.26,13.23 29.95,13.23 30.8,12.38 U1.3 v30.8,8.57 | 28.26,16.51 28.26,13.23 | 28.26,16.51 28.16,16.41 R4.2 C11.1 R8.2 R6.2 16.73,16.41 16.62,16.52 | C9.1 C16.1 12.07,16.41 11.75,16.09 | v11.75,22.54 11.75,19.37 11.75,16.09 | 11.75,16.09 C15.+ 11.75,15.88 11.75,14.29 | U3.5 11.75,14.29 | v10.8,14.29 11.75,14.29 | FL1.1 42.44,36.83 C18.1 41.91,36.73 C14.+ 40.01,35.1 38.24,33.34 v23.81,33.34
  Bottom 0.406: v11.75,22.54 11.75,27 15.01,30.26 16.83,30.26 | 16.83,30.26 23.71,30.26 v23.81,30.16 v23.81,33.34 | v16.82,33.02 v16.83,33.02 16.83,30.26 | v30.8,8.57 30.8,5.08 SV1.17 | SV1.1 10.48,5.08 10.48,13.97 v10.8,14.29
+5V
  Top 0.406: 13.65,6.35 SV1.2 U3.1 11.75,11.08 10.48,12.36 10.48,13.02 9.53,13.97 D2.C | 13.65,6.35 SV1.4 | U3.3 13.65,9.84 | 13.65,9.84 13.65,6.35 | C7.+ 13.76,9.74 13.65,9.84
AGND
  pour Top: 81.28,13.97 62.23,13.97 62.23,22.86 65.72,22.86 65.72,39.37 81.28,39.37
  pour Bottom: 81.28,13.97 62.23,13.97 62.23,22.86 65.72,22.86 65.72,39.37 81.28,39.37
AVDD  (via drill 0.35)
  Top 0.152: 47.42,20.65 C20.1
  Top 0.254: IC1.7 50.06,28.24 v50.16,28.34 | IC1.30 v47.42,22.23
  Top 0.406: v47.42,22.23 47.42,20.65 | C20.1 C19.1 | v50.16,32.38 50.16,34.51 FL2.2
  Bottom 0.406: v50.16,32.38 v50.16,28.34 50.16,23.18 49.21,22.23 v47.42,22.23
BOOT0  (via drill 0.35)
  Top 0.152: SW1.B 18.41,54.07 SW1.B' | v18.73,52.7 18.73,53.98 SW1.B' | v17.46,40.32 17.57,40.22 17.57,34.04 17.62,33.99 U2.60 | R1.2 21.79,54.07 SW1.B'
  Bottom 0.152: v17.46,40.32 17.46,44.45 18.1,45.09 18.1,52.07 v18.73,52.7
BOOT1  (via drill 0.35)
  Top 0.152: R2.1 22.21,13.21 v20.32,13.21 | U2.28 21.12,18.58 20.64,18.1 v20.32,18.1
  Bottom 0.152: v20.32,13.21 v20.32,18.1
BOOT_RX  (via drill 0.35)
  Top 0.152: U2.43 27.11,26.33 v27.49,26.71
  Bottom 0.152: v27.49,26.71 29.53,28.75 29.53,44.45 28.26,45.72 28.26,46.99 36.51,55.24 39.37,55.24 J1.2
BOOT_TX  (via drill 0.35)
  Top 0.152: U2.42 27.47,25.83 27.96,26.32 28.56,26.32 v29.22,26.99
  Bottom 0.152: v29.22,26.99 30.19,27.95 30.19,32.74 30.8,33.34 30.8,46.74 37.72,53.66 J1.3
CLOCK  (via drill 0.35)
  Top 0.152: v49.17,23.36 49.17,23.79 IC1.32 | R17.2 36.73,22.86 | 36.73,22.86 R18.2 | 36.73,22.86 v40.32,22.86
  Bottom 0.152: v40.32,22.86 48.67,22.86 v49.17,23.36
D+
  Top 0.152: R5.1 6.67,9.84 6.35,10.16 6.35,11.75 6.03,12.06 J4.3
D-
  Top 0.152: J4.2 6.75,12.71 R7.1
ENET_MDC  (via drill 0.35)
  Top 0.152: v22.75,26.04 21.11,26.04 19.91,24.83 U2.9 | v29.21,26.04 29.25,26.08 42.9,26.08 43.06,26.24 IC1.22
  Bottom 0.152: v29.21,26.04 29.2,26.05 22.76,26.05 v22.75,26.04
ENET_MDIO  (via drill 0.35)
  Top 0.152: v40.01,33.02 41.17,31.85 R12.1 | v22.23,24.43 21.91,24.11 20.96,24.11 18.18,21.33 U2.16 | v28.26,25.44 28.94,25.44 28.96,25.43 29.78,25.43 30.04,25.69 39.77,25.69 v40.01,25.45 40.29,25.74 IC1.23
  Bottom 0.152: v22.23,24.43 22.23,24.54 23.13,25.44 v28.26,25.44 | v40.01,33.02 v40.01,25.45
GND  (via drill 0.35, 3.28)
  Top 0.254: IC1.31 47.92,25.74 IC1.33
  Bottom 0.152: J6.10 74.24,32.76 70.48,36.51 v63.5,36.51
  other vias: 6.67,5.08 48.58,5.08 6.67,45.72 48.58,45.72 20.32,10.48 24.77,10.48 22.23,10.16 19.68,35.24 8.89,20.64 10.16,18.1 12.7,8.89 11.43,32.38 14.92,23.18 13.97,19.68 48.26,23.5 28.26,23.18 18.73,29.21 47.94,35.56 44.13,31.11 15.88,29.21 22.23,17.78 17.46,28.26 30.16,14.92 34.61,16.83 39.05,8.57 29.53,8.57 37.47,13.34 40.32,24.13 25.08,18.73 77.47,45.72 77.47,5.08 56.2,18.41 42.86,29.21 43.5,22.23 28.57,31.75 28.57,30.16 37.15,31.11 31.43,37.15 30.16,37.15 28.57,37.15 34.92,27.62 16.51,40.96 45.72,26.04 47.62,26.04 6.03,24.77 6.03,35.56
  pour Bottom: 0,0 81.28,0 81.28,11.43 59.69,11.43 59.69,35.56 64.45,35.56 64.45,41.91 81.28,41.91 81.28,57.15 0,57.15
  pour Top: 81.28,0 81.28,11.43 59.69,11.43 59.69,35.56 64.45,35.56 64.45,41.91 81.28,41.91 81.28,57.15 0,57.15 0,0
I2C0_SCL  (via drill 0.35)
  Top 0.152: v18.73,13.34 19.58,13.34 R8.1 | U2.61 17.12,29.87 v17.46,29.53
  Bottom 0.152: SV1.5 18.1,5.08 18.1,6.99 18.73,7.62 v18.73,13.34 18.73,28.26 v17.46,29.53
I2C0_SDA  (via drill 0.35)
  Top 0.152: v15.88,26.98 16.62,27.71 U2.62 | v17.46,13.34 18.73,14.61 R6.1
  Bottom 0.152: SV1.3 15.56,5.08 15.56,7.08 17.46,8.98 v17.46,13.34 17.46,16.51 15.88,18.09 v15.88,26.98
LED0  (via drill 0.35)
  Top 0.152: R13.1 R14.2 51.44,20.64 v50.16,21.91 | IC1.24 44.22,24.7 v41.2,21.67
  Bottom 0.152: v50.16,21.91 49.51,21.91 49.22,21.62 41.25,21.62 v41.2,21.67
LED1
  Top 0.152: R16.2 R15.2 40.92,20.54 IC1.25
LED_ACTIVE-  (via drill 0.35)
  Top 0.152: v56.2,20.64 R14.1
  Bottom 0.152: v56.2,20.64 60.72,20.64 62.77,22.7 70.97,22.7 74.35,19.31 J6.12
LED_LINK+
  Top 0.152: J6.9 72.39,28.82 60.58,17 42.47,17 R15.1
N$1
  Top 0.152: IC1.2 50.88,25.74 C24.2
N$4
  Top 0.152: IC1.1 51.5,22.86 R21.1
N$5
  Top 0.152: R11.2 49.91,29.53 IC1.8
N$6
  Top 0.152: IC1.29 46.92,22.79 45.09,20.95 C25.2
N$7
  Top 0.152: IC1.28 46.42,23.88 44.13,21.59 43.18,21.59 42.86,21.27 R19.2
N$9
  Top 0.152: J6.5 59.37,25.4 59.05,25.08 C27.1
N$10
  Top 0.152: LED2.A 5.06,21.91 RN1.1
N$11
  Top 0.152: LED3.A 4.76,20.64 5.15,20.25 RN1.2
N$12
  Top 0.152: C26.1 58,22.86 59.27,24.13 61.04,24.13 63.5,26.59 J6.4
N$25
  Top 0.152: LED4.A 4.76,19.37 5.15,19.75 RN1.3
N$26
  Top 0.152: LED1.A 5.06,18.1 RN1.4
NRST  (via drill 0.35)
  Top 0.152: U2.7 14.4,25.83 14.63,26.06 14.63,39.98 14.61,40.01 v14.61,43.81 | SW4.B' SW4.B 26.03,52.39 C17.1 R9.1 24.03,48.68 24.13,48.58 | v40.64,41.27 34.61,41.27 J5.6 27.3,48.58 24.13,48.58 | v16.83,48.58 24.13,48.58 | IC1.21 42.93,26.74 v42.83,26.84
  Bottom 0.152: v42.83,26.84 42.37,27.3 41.48,27.3 40.64,28.15 v40.64,41.27 | v14.61,43.81 14.61,44.45 15.56,45.4 15.56,47.31 v16.83,48.58
OSC32_IN
  Top 0.152: C5.2 11.11,33.99 Q2.2 11.09,33 10.44,32.34 10.44,30.2 12.81,27.83 U2.3
OSC32_OUT
  Top 0.152: C6.2 8.59,35.64 Q2.1 8.59,30.98 12.24,27.33 U2.4
OSC_IN
  Top 0.152: 6.03,32.38 R3.1 6.77,31.01 10.95,26.83 U2.5 | 6.03,32.38 C2.2 | Q1.2 2.54,33.33 3.48,32.38 6.03,32.38
OSC_OUT
  Top 0.152: R3.2 C4.2 | C4.2 8.68,27.84 10.18,26.33 U2.6 | Q1.1 2.54,27 3.38,27.84 C4.2
PA4/DAC0  (via drill 0.35)
  Top 0.152: U2.20 17.12,20.23 16.78,20.57 v16.78,20.64 | v16.51,26.04 17.78,27.3 20.64,27.3 21.91,28.57 v21.91,28.62
  Bottom 0.152: v16.78,20.64 16.51,20.91 v16.51,26.04 | v21.91,28.62 22.6,29.31 23.82,29.31 24.45,29.94 J5.8
PA5/DAC1  (via drill 0.35)
  Top 0.152: U2.21 17.62,20.07 v18.01,20.46 | v21.59,27.26 20.36,26.04 v18.01,26.04
  Bottom 0.152: v18.01,20.46 v18.01,26.04 | J5.7 25.72,45.09 25.72,30.68 24.04,29.01 23.1,29.01 22.54,28.45 22.54,28.21 v21.59,27.26
PA6  (via drill 0.35)
  Top 0.152: U2.22 18.12,18.43 v17.78,18.1 | v20.64,8.89 v18.1,8.89 | SV1.7 19.37,3.17 20.64,1.91 52.58,1.91 SW2.B' SW2.B
  Bottom 0.152: v17.78,18.1 18.1,17.78 v18.1,8.89 | v20.64,8.89 20.64,5.08 SV1.7
PA8
  Top 0.152: U2.41 27.37,25.33 27.97,24.74 34.54,24.74 34.83,24.45 R18.1
PA11  (via drill 0.35)
  Top 0.152: SV1.22 35.88,5.08 10.98,5.08 10.48,5.58 10.48,10.69 R7.2 | U2.44 26.49,26.83 26.99,27.33 28.39,27.33 28.65,27.59 31.14,27.59 31.72,27.02 36.51,27.02 v36.83,27.33
  Bottom 0.152: SV1.22 36.83,6.67 v36.83,27.33
PA12  (via drill 0.35)
  Top 0.152: R4.1 26.89,14.71 v26.99,14.61 | v26.99,10.48 24.45,7.94 v15.56,7.94 | v10.48,2.54 9.11,3.91 R5.2 | v32.7,27.62 32.18,27.62 31.88,27.93 28.24,27.93 27.95,27.64 26.86,27.64 26.56,27.33 U2.45 | v32.7,18.73 v27.62,18.73
  Bottom 0.152: v15.56,7.94 15.52,7.98 13.88,7.98 13.06,7.15 13.06,3.21 12.38,2.54 v10.48,2.54 | v26.99,10.48 v26.99,14.61 27.62,15.24 v27.62,18.73 | v32.7,27.62 v32.7,18.73
PA13/SWDIO  (via drill 0.35)
  Top 0.152: U2.46 26.34,27.83 28.01,29.5 32.04,29.5 v32.07,29.53
  Bottom 0.152: J5.5 v32.07,29.53 SV1.18
PA14/SWCLK  (via drill 0.35)
  Top 0.152: U2.49 24.79,30.88 24.8,30.87 28.69,30.87 29.87,32.05 v39.39,32.05
  Bottom 0.152: SV1.26 42.23,13.97 39.39,16.81 v39.39,32.05 39.39,40.71 37.77,42.33 37.77,45.74 J5.3
PB1  (via drill 0.35)
  Top 0.152: v24.45,13.34 25.4,12.38 27.3,12.38 28.26,11.43 U1.1 | v23.8,20.77 23.72,20.77 23.11,21.38 22.09,21.38 20.62,19.91 U2.27
  Bottom 0.152: v24.45,13.34 24.43,13.35 24.43,20.13 v23.8,20.77
PB10  (via drill 0.35)
  Top 0.152: U2.29 21.62,19.91 22.48,20.77 v22.86,20.77
  Bottom 0.152: SV1.12 24.45,6.99 23.81,7.62 23.81,19.82 v22.86,20.77
PB14  (via drill 0.35)
  Top 0.152: v28.23,21.91 27.9,22.24 26,22.24 25.91,22.33 U2.35 | SW3.B SW3.B' 65.18,2.95 v63.82,1.59
  Bottom 0.152: v28.23,21.91 28.26,21.88 28.26,5.08 SV1.15 31.75,1.59 v63.82,1.59
PB15  (via drill 0.35)
  Top 0.152: U2.36 25.84,22.83 26.13,22.54 v29.53,22.54
  Bottom 0.152: v29.53,22.54 28.92,21.94 28.92,6.96 SV1.16
PC0
  Top 0.152: U2.8 10.5,25.33 7.17,22 RN1.8
PC2
  Top 0.152: RN1.7 7.39,20.25 7.65,20.51 7.65,22.05 9.93,24.33 U2.10
PC3
  Top 0.152: RN1.6 7.48,19.75 8.26,20.52 8.26,22.23 9.86,23.83 U2.11
PC8  (via drill 0.35)
  Top 0.152: v26.32,36.51 v19.68,36.51 | U2.39 24.59,24.33 23.35,25.57 v23.35,28.4
  Bottom 0.152: J2.1 2.86,45.4 5.4,42.86 10.79,42.86 17.14,36.51 v19.68,36.51 | v23.35,28.4 24.07,28.4 26.32,30.66 v26.32,36.51
PC9  (via drill 0.35)
  Top 0.152: v27.62,37.78 v19.68,37.78 | U2.40 24.59,24.83 23.97,25.45 v23.97,27.74
  Bottom 0.152: v23.97,27.74 24.68,27.74 27.62,30.68 v27.62,37.78 | v19.68,37.78 18.1,37.78 5.4,50.48 J2.2
PC13
  Top 0.152: U2.2 12.89,28.33 12.04,29.18 12.04,40.3 12.06,40.32 12.06,43.79 7.94,47.92 J2.3
PHY_INT  (via drill 0.35)
  Top 0.152: v48.58,31.43 50.59,31.43 R10.1 51.44,32.28 v51.44,31.11 | v46.99,31.11 46.99,30.48 47.42,30.05 IC1.11 | U2.26 20.12,19.91 21.89,21.68 23.75,21.68 25.08,20.35 36.8,20.35 37.47,19.68 v41.82,19.68
  Bottom 0.152: v48.58,31.43 47.31,31.43 v46.99,31.11 | v51.44,31.11 51.44,21.37 49.75,19.68 v41.82,19.68
RD+
  Top 0.152: IC1.5 60.26,27.24 J6.3
RD-  (via drill 0.35)
  Top 0.152: v58.42,27.84 58.14,27.84 58.04,27.74 IC1.6
  Bottom 0.152: v58.42,27.84 58.52,27.84 59.69,26.67 61.04,26.67 63.5,24.21 J6.6
RMII_CRS_DV  (via drill 0.35)
  Top 0.152: RN2.4 30.31,26.5 v30.13,26.69 | U2.23 18.62,21.02 21.11,23.52 v23.41,23.52
  Bottom 0.152: v23.41,23.52 23.7,23.81 27.85,23.81 30.13,26.1 v30.13,26.69
RMII_REF_CLK  (via drill 0.35)
  Top 0.152: U2.15 17.93,21.83 21.13,25.04 22.68,25.04 v23.13,24.59 | R17.1 34.2,22.23 32.32,24.1 27.1,24.1 v26.67,24.54
  Bottom 0.152: v23.13,24.59 23.18,24.54 v26.67,24.54
RMII_RXD0  (via drill 0.35)
  Top 0.152: U2.24 19.12,20.78 21.21,22.87 22.14,22.87 v22.21,22.8 | RN2.3 38.67,27.05 37.47,28.26 v27.62,28.26
  Bottom 0.152: v22.21,22.8 22.21,22.91 21.62,23.5 21.62,25.77 22.49,26.64 26.01,26.64 v27.62,28.26
RMII_RXD1  (via drill 0.35)
  Top 0.152: v28.56,28.89 37.47,28.89 38.8,27.55 RN2.2 | U2.25 19.62,20.42 v21.46,22.26
  Bottom 0.152: v21.46,22.26 21.31,22.41 21.31,25.89 22.55,27.13 25.15,27.13 26.91,28.89 v28.56,28.89
RMII_TX_EN  (via drill 0.35)
  Top 0.152: RN3.4 33.82,29.36 32.7,30.48 v31.46,30.48 | v31.43,19.68 31.38,19.74 25.05,19.74 24.63,20.16 22.37,20.16 22.12,19.91 U2.30
  Bottom 0.152: v31.43,19.68 31.43,30.45 v31.46,30.48
RMII_TXD0  (via drill 0.35)
  Top 0.152: U2.33 26.27,21.33 26.62,20.98 34.26,20.98 v34.29,20.95 | RN3.2 34.74,30.41 v34.32,30.84
  Bottom 0.152: v34.29,20.95 34.29,30.81 v34.32,30.84
RMII_TXD1  (via drill 0.35)
  Top 0.152: U2.34 26.49,21.83 27.02,21.3 30.39,21.3 30.8,21.71 v30.8,21.91 | RN3.3 34.02,29.91 32.72,31.21 v30.8,31.21
  Bottom 0.152: v30.8,31.21 v30.8,21.91
RXD0  (via drill 0.35)
  Top 0.152: v48.9,30.48 48.42,30.01 IC1.9 | v42.05,27.91 41.2,27.05 RN2.6
  Bottom 0.152: v48.9,30.48 48.9,30.31 46.5,27.91 v42.05,27.91
RXD1  (via drill 0.35)
  Top 0.152: R20.2 47.92,32.47 v47.92,30.48 IC1.10 | v41.25,28.39 40.41,27.55 RN2.7
  Bottom 0.152: v47.92,30.48 46.02,28.57 41.25,28.57 v41.25,28.39
RXDV  (via drill 0.35)
  Top 0.152: v41.92,26.68 41.74,26.5 RN2.5 | IC1.26 45.42,23.95 v45.02,23.55
  Bottom 0.152: v45.02,23.55 41.92,26.66 v41.92,26.68
SPI2_MISO  (via drill 0.35)
  Top 0.152: U2.56 19.62,32.95 21.55,34.88 35.6,34.88 v35.88,35.16 | U1.2 v29.53,12.06 | v31.46,13.39 35.82,13.39 v35.88,13.34
  Bottom 0.152: SV1.21 35.88,5.08 v35.88,13.34 v35.88,35.16 | v29.53,12.06 30.86,13.39 v31.46,13.39
SPI2_MOSI  (via drill 0.35)
  Top 0.152: v33.34,16.83 33.38,16.87 33.08,17 U1.5 | U2.57 19.12,33.41 21.59,35.88 v33.34,35.88
  Bottom 0.152: SV1.19 33.34,5.08 v33.34,16.83 v33.34,35.88
SPI2_NSS  (via drill 0.35)
  Top 0.152: U2.50 22.62,31.82 23.47,32.67 v38.73,32.67
  Bottom 0.152: SV1.24 39.69,15.24 38.73,16.19 v38.73,32.67
SPI2_SCK  (via drill 0.35)
  Top 0.152: U2.55 20.12,32.5 21.85,34.23 37.15,34.23 v38.1,35.19 | v38.42,14.61 32.07,14.61 30.8,15.88 U1.6
  Bottom 0.152: SV1.23 38.42,5.08 v38.42,14.61 38.1,14.92 v38.1,35.19
TD+  (via drill 0.35)
  Top 0.152: IC1.3 55.99,26.24 v56.2,26.04
  Bottom 0.152: v56.2,26.04 56.2,26.48 60.2,30.48 J6.1
TD-
  Top 0.152: J6.2 63.5,29.13 61.1,26.74 IC1.4
TXD0
  Top 0.152: RN3.7 43.81,30.41 43.95,30.41 IC1.16
TXD1
  Top 0.152: RN3.6 43.05,29.91 IC1.17
TXEN
  Top 0.152: RN3.5 41.77,29.36 43.18,27.96 43.18,27.88 43.82,27.24 IC1.20
UART4_RX  (via drill 0.35)
  Top 0.152: U2.54 20.62,31.98 v21,32.36
  Bottom 0.152: J5.10 21,44.73 v21,32.36
UART4_TX  (via drill 0.35)
  Top 0.152: U2.53 21.12,31.57 21.91,32.36 v21.91,32.99
  Bottom 0.152: J5.9 v21.91,32.99
USART0_RX  (via drill 0.35)
  Top 0.152: U2.59 18.12,35.19 v18.17,35.24 | v13.65,38.1 13.65,45.72 J5.12
  Bottom 0.152: v18.17,35.24 16.51,35.24 v13.65,38.1
USART0_TX
  Top 0.152: U2.58 18.62,33.88 18.78,34.04 18.78,44.4 J5.11
USART2_RX  (via drill 0.35)
  Top 0.152: v20.93,28.75 20.93,29.39 21.62,30.08 U2.52
  Bottom 0.152: SV1.10 21.56,6.7 21.56,10.09 20.93,10.73 20.93,21.81 20.85,21.88 20.85,28.68 v20.93,28.75
USART2_TX  (via drill 0.35)
  Top 0.152: v21.92,29.53 22.12,29.72 U2.51
  Bottom 0.152: SV1.8 19.37,28.05 20.84,29.53 v21.92,29.53
USART5_RX  (via drill 0.35)
  Top 0.152: U2.38 25.2,23.81 24.57,23.81 24.04,23.27 v24.04,22.23
  Bottom 0.152: SV1.11 23.18,5.08 23.18,11.11 21.62,12.67 21.62,21.02 22.82,22.23 v24.04,22.23
USART5_TX  (via drill 0.35)
  Top 0.152: U2.37 26.52,23.33 v26.67,23.18
  Bottom 0.152: v26.67,23.18 26,22.5 26,4.8 SV1.13
VBAT  (via drill 0.35)
  Top 0.203: D1.C 12.7,35.24 | 12.7,35.24 12.7,31.01 C1.1 12.91,30.55 12.88,30.51 12.88,30.1 13.52,29.47 U2.1 | 12.7,35.24 v12.7,39.69
  Bottom 0.203: v12.7,39.69 7.94,39.69 J3.2
VBUS
  Top 0.406: J4.1 6.23,13.37 D2.A 6.84,17.71 C3.2
VDD  (via drill 0.35)
  Top 0.152: C21.+ 45.94,38.62 | R12.2 42.27,33.6 v43.44,33.6 | v46.86,33.66 45.94,33.66
  Top 0.254: IC1.14 45.92,32.37
  Top 0.406: v54.29,18.41 R13.2 | 45.94,38.62 FL1.2 | FL1.2 C22.1 45.94,33.66 C23.1 45.92,32.37 | FL1.2 50.48,36.83 51.97,35.34 FL2.1 53.24,33.34 R10.2 R11.1 53.66,29.53 v54.29,28.89
  Bottom 0.152: v43.44,33.6 46.81,33.6 v46.86,33.66 | J6.11 69.42,16.34 56.37,16.34 v54.29,18.41
  Bottom 0.406: v54.29,28.89 v54.29,18.41

### Text on the board
tNames: www.gd32-dmx.org | PC8 | PC9 | PC13 | TX | RX | GND | GND | RX_0 | TX_0 | RX_4 | TX_4 | DAC0 | DAC1 | NRST | SWDIO | GND | SWCLK | GND | GD32F107Rx / GD32F207Rx / GD32F407Rx | VBAT+ | GND | + | + | + | + | + | + | +5V | +5V | GND | TX_2 | RX_2 | PB10 | GND | PB15 | PA13 / SWDIO | GND | PA11 | NSS | PA14 / SWCLK | POWER / DFU | +3V3 | SDA | SCL | PA6 | GND | RX_5 | TX_5 | PB14 | +3V3 | MOSI | MISO | SCK | GND